# Altium schematic sheet Flash.SchDoc: Flash memory
size Letter; CompanyName: Hello Inc.; DrawnBy: D. Fusi; Organization: Hello Inc.; DocumentNumber: 5; Revision: DVT; SheetNumber: 5; SheetTotal: 7
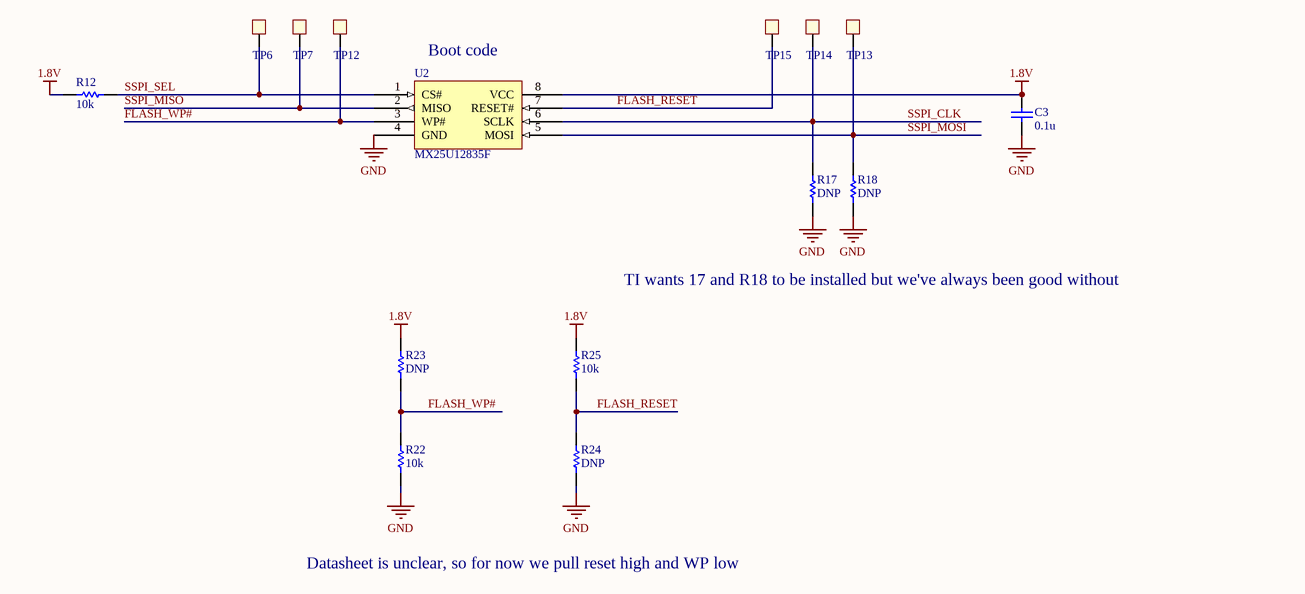
[diagram p0: Flash.SchDoc]

## Parts
C3  0.1u  [CAP0402_SENSE_DVT]
R12  10k  [RES0402_SENSE_DVT]
R17  DNP  [RES0402_SENSE_DVT]
R18  DNP  [RES0402_SENSE_DVT]
R22  10k  [RES0402_SENSE_DVT]
R23  DNP  [RES0402_SENSE_DVT]
R24  DNP  [RES0402_SENSE_DVT]
R25  10k  [RES0402_SENSE_DVT]
TP6  TP  [TP-1.1]  (value not drawn)
TP7  TP  [TP-1.1]  (value not drawn)
TP12  TP  [TP-1.1]  (value not drawn)
TP13  TP  [TP-1.1]  (value not drawn)
TP14  TP  [TP-1.1]  (value not drawn)
TP15  TP  [TP-1.1]  (value not drawn)
U2  MX25U12835F  [WSON 8L]

## Nets
1.8V: C3.2 R12.1 R23.2 R25.2 U2.8(VCC)
GND: C3.1 R17.1 R18.1 R22.1 R24.1 U2.4(GND)
FLASH_RESET: R24.2 R25.1 TP15.1 U2.7(RESET#)
FLASH_WP#: R22.2 R23.1 TP12.1 U2.3(WP#)
SSPI_CLK: R17.2 TP14.1 U2.6(SCLK)
SSPI_MISO: TP7.1 U2.2(MISO)
SSPI_MOSI: R18.2 TP13.1 U2.5(MOSI)
SSPI_SEL: R12.2 TP6.1 U2.1(CS#)

## Notes on the sheet
- (near U2) Boot code
- TI wants 17 and R18 to be installed but we've always been good without
- Datasheet is unclear, so for now we pull reset high and WP low
- TITLE
- DATE
- DRAWN BY
- REV
- SHEET
- OF

## Library data of the parts
C3 = C_0.1u_10_50_X7R_0402: Chip capacitor; Vendor: Taiyo Yuden; PN: UMK105B7104KV-FR; Tolerance: 10%; Voltage: 50V; Temp: X7R; Hello_PN: 225-00468; Value: 0.1u; Size: 0402; item_category: Capacitor
R12 R22 R25 = R_10k_5_0.1_0402: Chip Resistor; Vendor: Panasonic; Tolerance: 5 %; Power: 0.1 W; PN: ERJ-2GEJ103X; Hello_PN: 220-00409; Model: *; Value: 10k; Size: 0402; item_category: Resistor
R17 R18 = R_100k_1_0.1_0402: Chip Resistor; Value: 100k; Vendor: Panasonic; Tolerance: 1 %; Power: 0.1 W; PN: ERJ-2RKF1003X; Hello_PN: 220-00403; Model: *; Size: 0402; item_category: Resistor
R23 R24 = R_10k_5_0.1_0402: Chip Resistor; Value: 10k; Vendor: Panasonic; Tolerance: 5 %; Power: 0.1 W; PN: ERJ-2GEJ103X; Hello_PN: 220-00409; Model: *; Size: 0402; item_category: Resistor
TP6 TP7 TP12-TP15 = TP: testpoint
U2 = MX25U12835F: Macronix MX25U12835F SPI NOR Flash; Hello_PN: 255-00024; item_category: IC_Digital; PN: MX25U12835F; Vendor: Macronix